# EasyEDA schematic SCH_μAtlas_2026-06-22.json

## Sheets
1 PWR_Management: TITLE: PWR Management; REV: 1.0; Date: 2026-06-20; Sheet: 1/1; Drawn By: httperry; Company: HackClub - Macondo
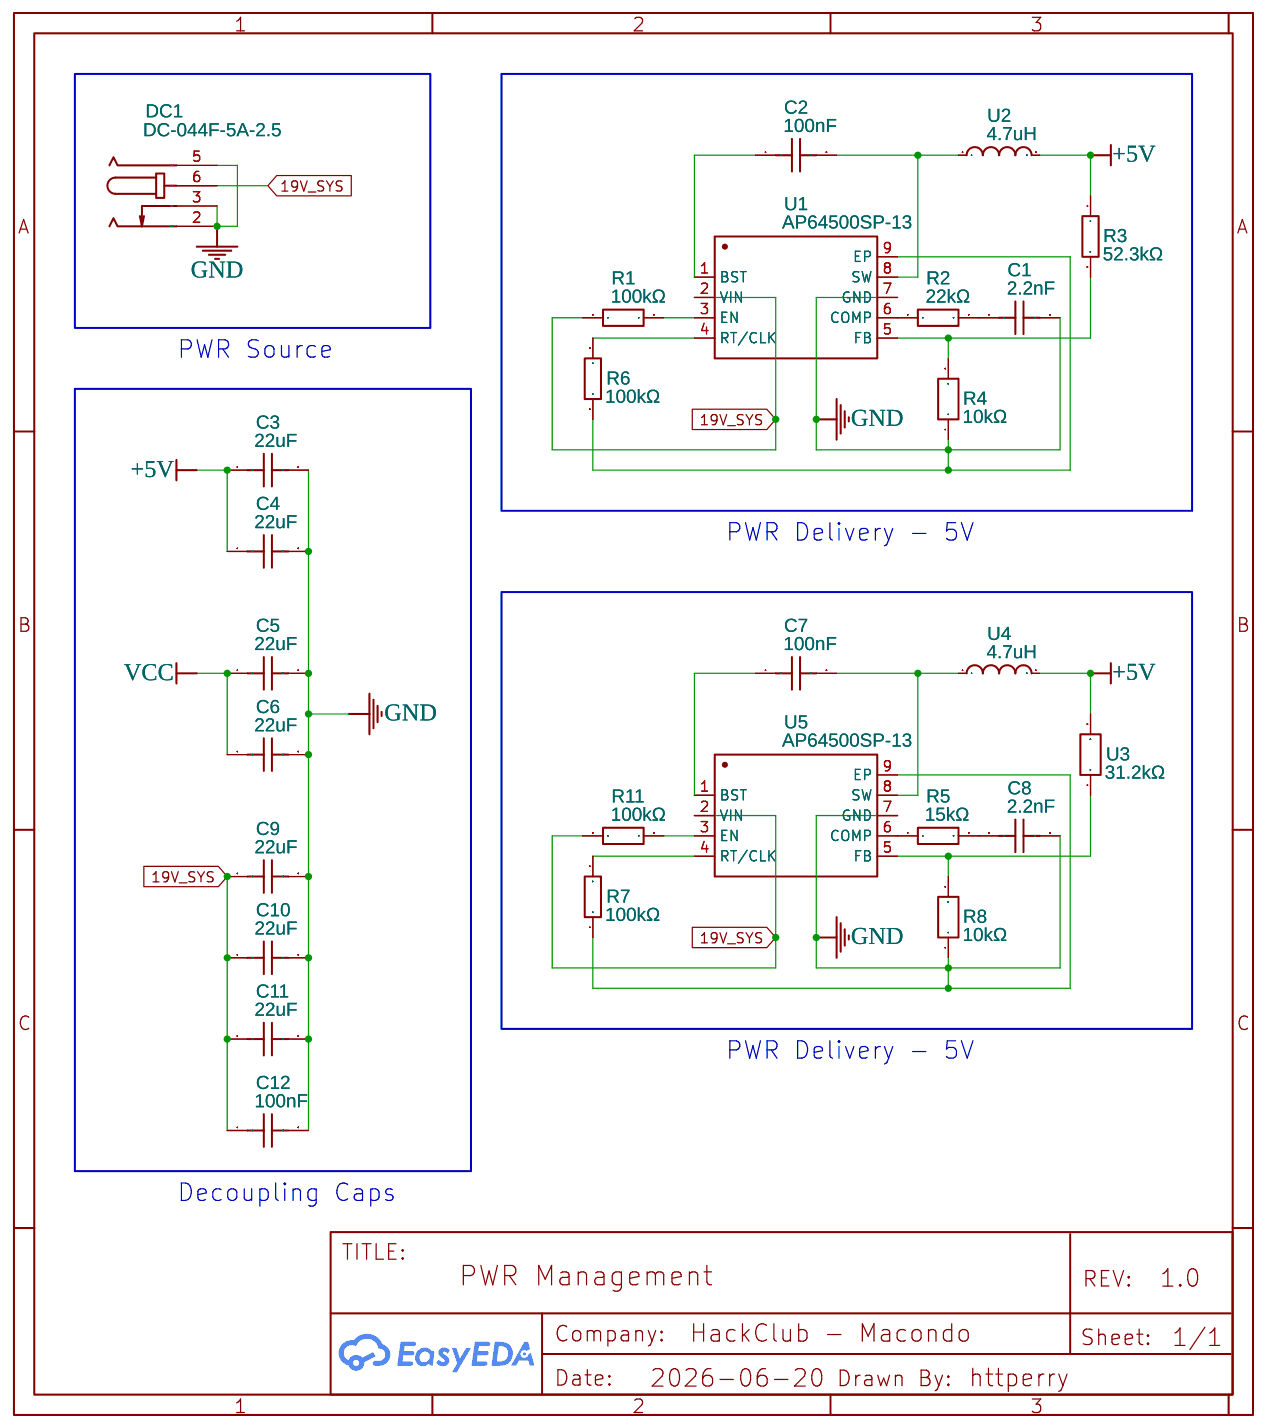
[diagram p0: PWR_Management]
2 SATA_Ports: TITLE: SATA Ports; Date: 2026-06-21
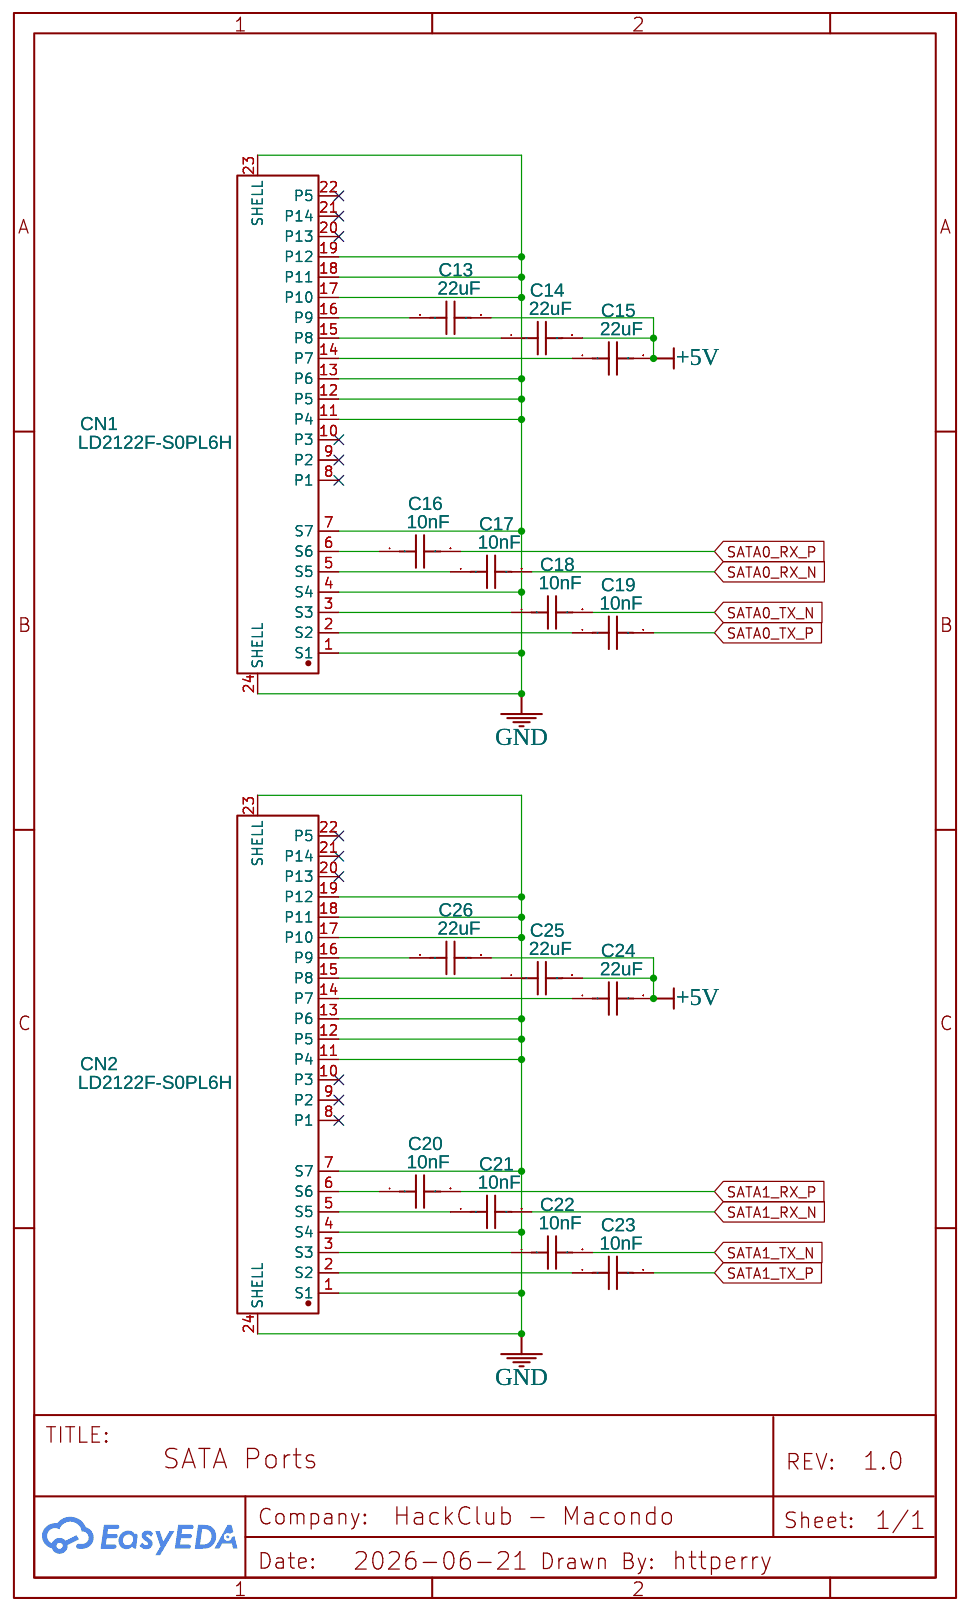
[diagram p1: SATA_Ports]
3 NVMe_(Networking)_Ports: TITLE: NVMe (Networking) Ports; Date: 2026-06-21; Company: HackClub Macondo
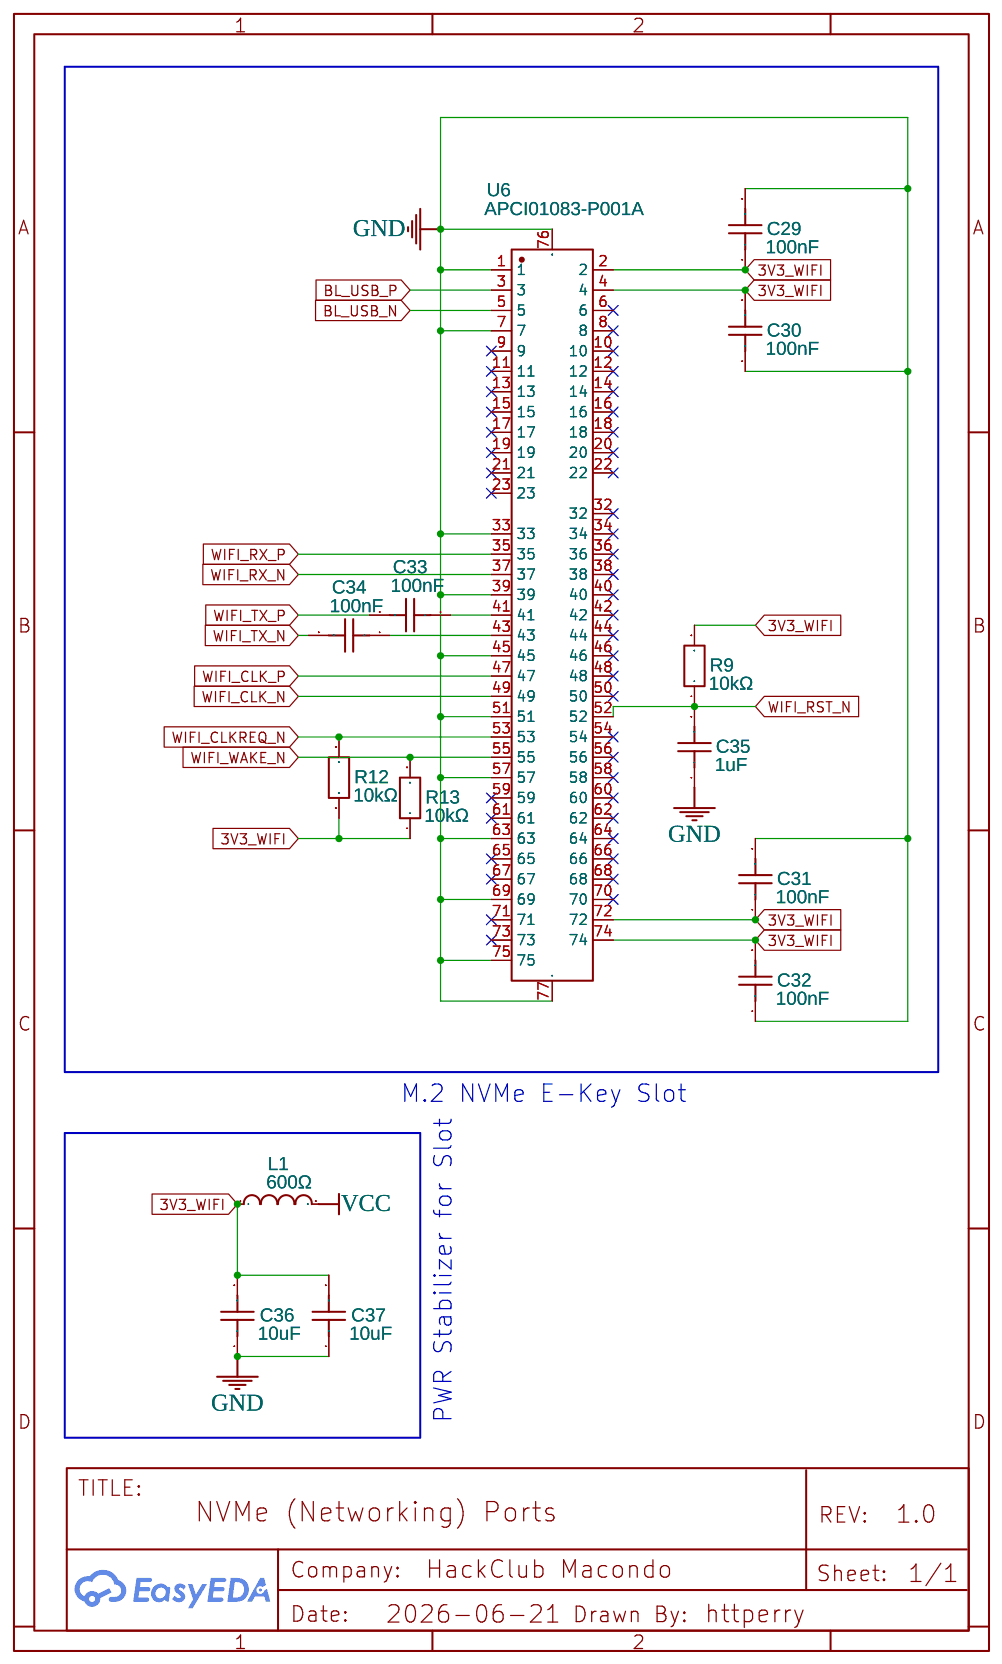
[diagram p2: NVMe_(Networking)_Ports]
4 NVMe_(Storage)_Ports: TITLE: NVMe (Storage) Ports; Date: 2026-06-22; Company: HackClub Macondo
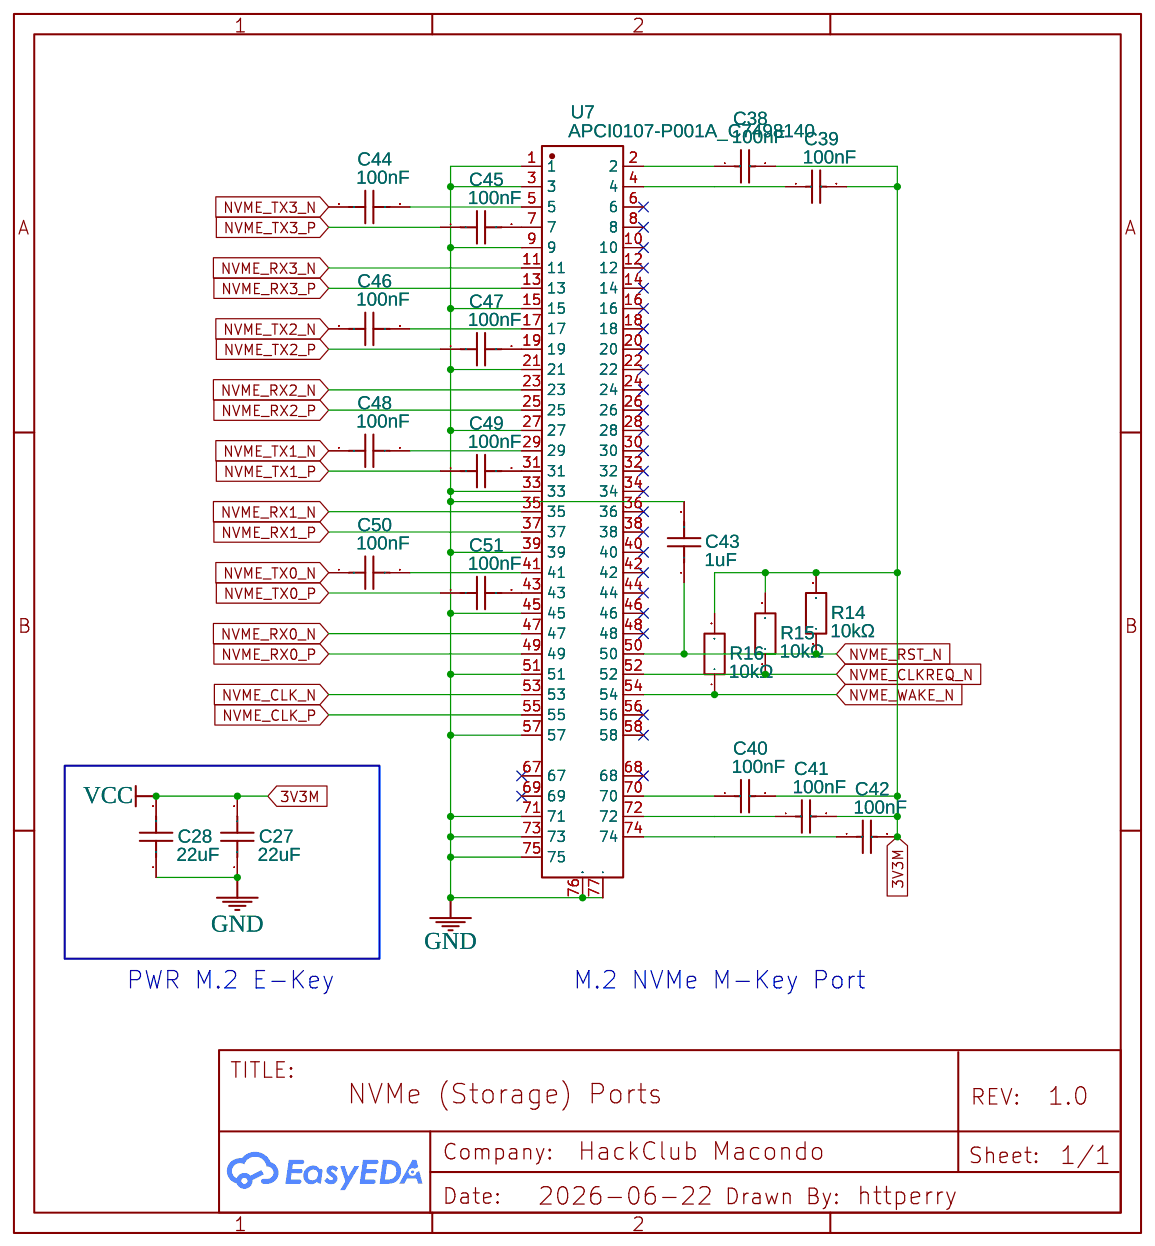
[diagram p3: NVMe_(Storage)_Ports]
5 IO_Ethernet: TITLE: IO_Ethernet; Date: 2026-06-22; Company: HackClub Macondo
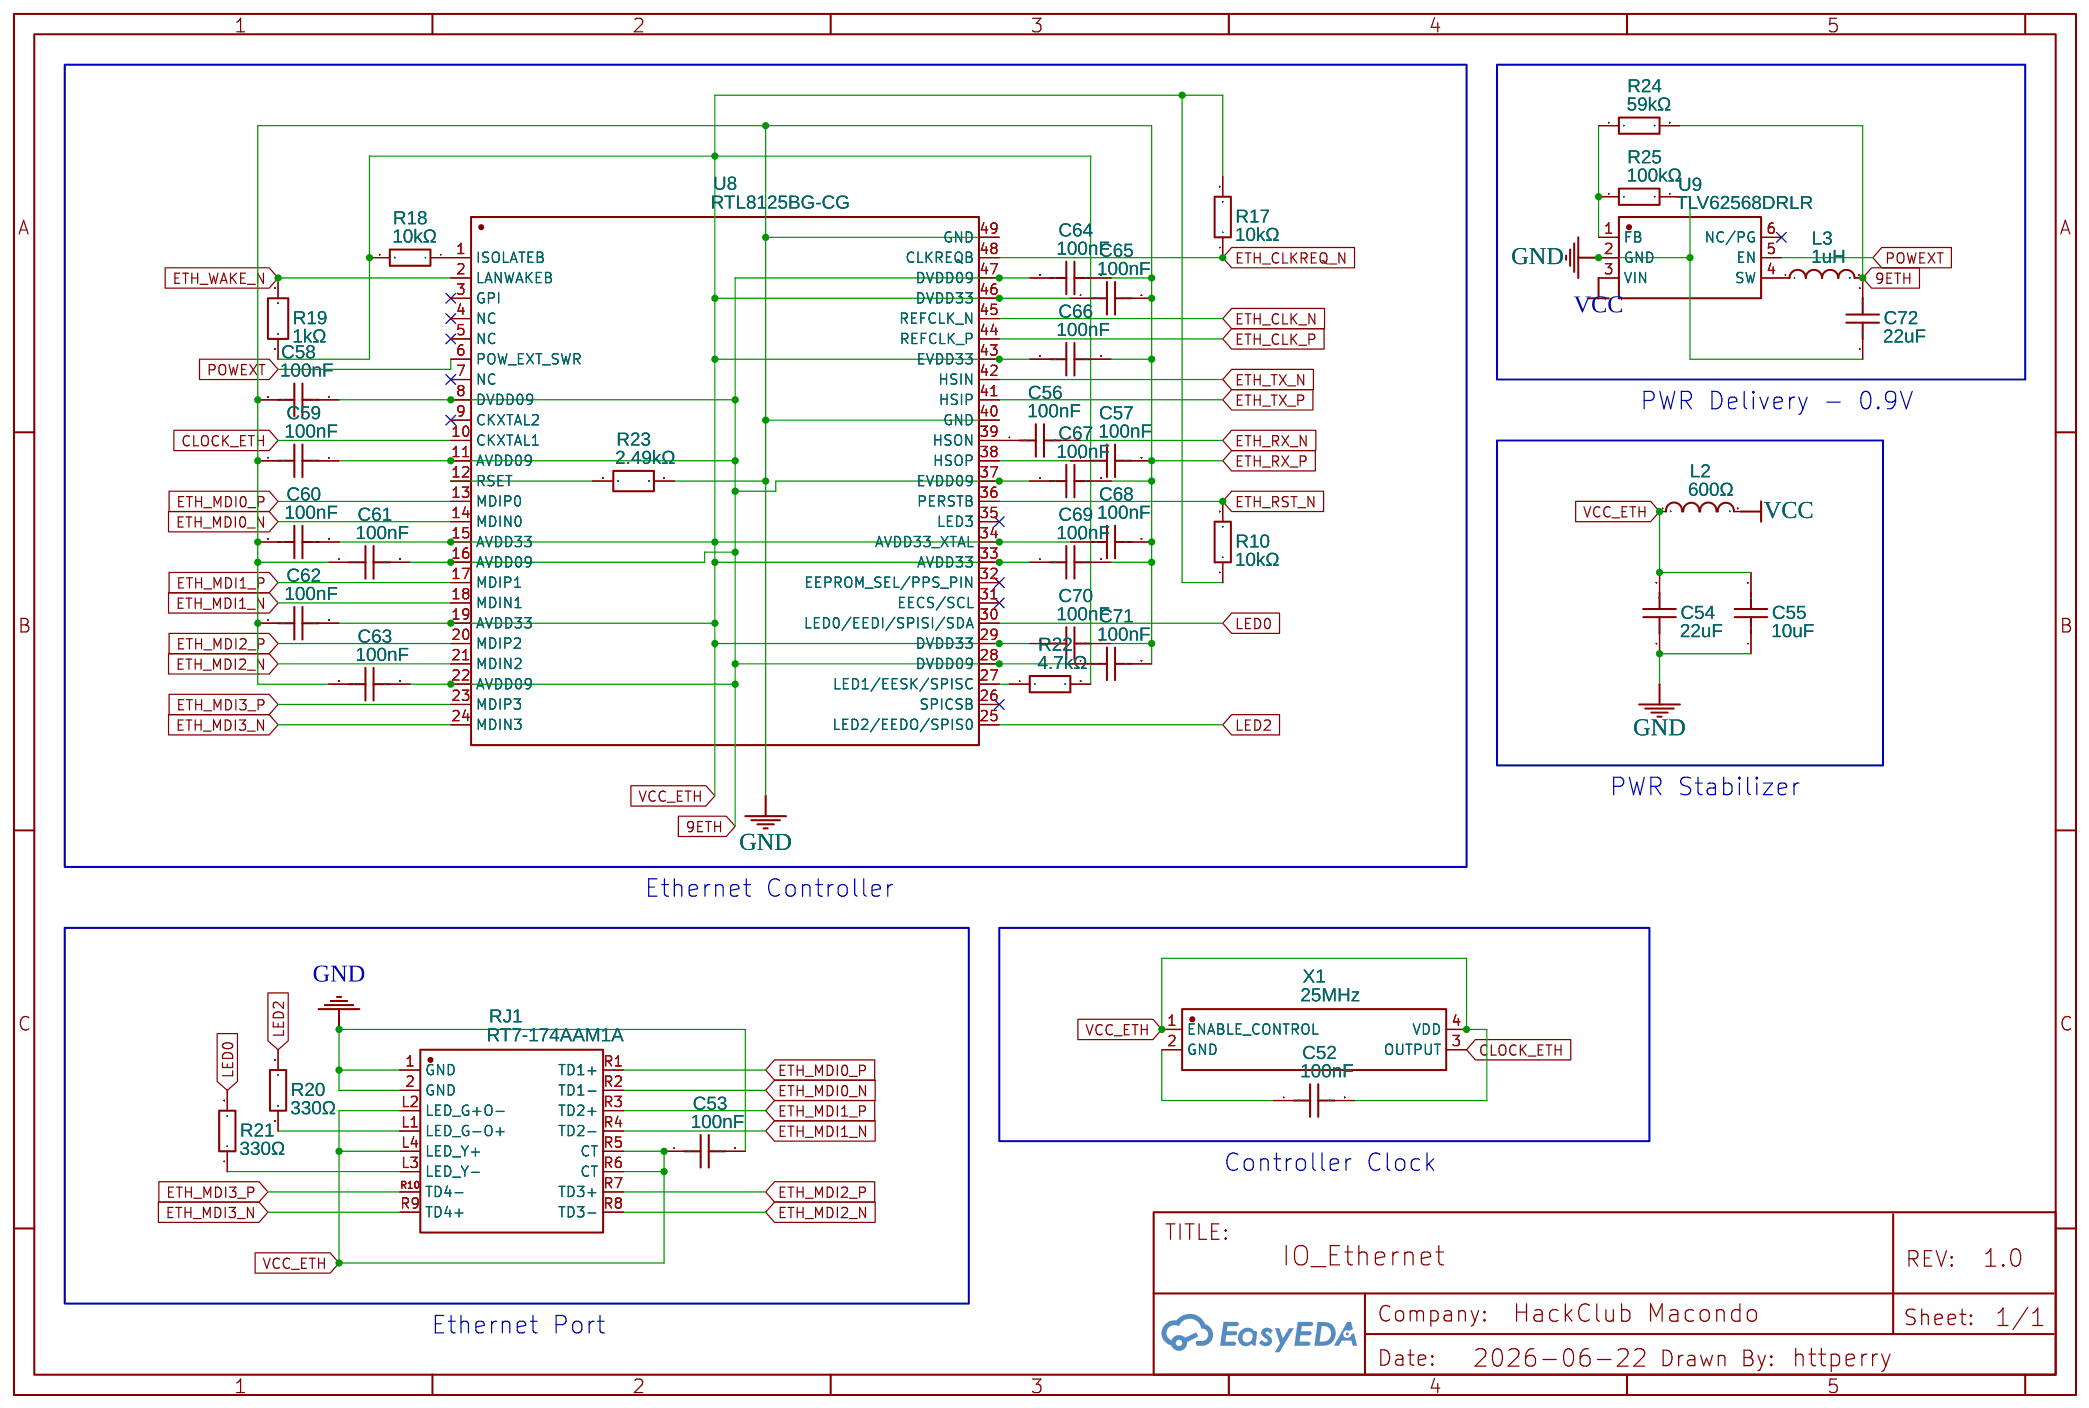
[diagram p4: IO_Ethernet]

## Parts
sheet IO_Ethernet
C52  100nF  [C0402]
C53  100nF  [C0402]
C54  22uF  [C0805]
C55  10uF  [C0805]
C56  100nF  [C0402]
C57  100nF  [C0402]
C58  100nF  [C0402]
C59  100nF  [C0402]
C60  100nF  [C0402]
C61  100nF  [C0402]
C62  100nF  [C0402]
C63  100nF  [C0402]
C64  100nF  [C0402]
C65  100nF  [C0402]
C66  100nF  [C0402]
C67  100nF  [C0402]
C68  100nF  [C0402]
C69  100nF  [C0402]
C70  100nF  [C0402]
C71  100nF  [C0402]
C72  22uF  [C0805]
L2  600Ω  [L0805]
L3  1uH  [IND-SMD_L2.0-W1.6-B]
R10  10kΩ  [R0402]
R17  10kΩ  [R0402]
R18  10kΩ  [R0402]
R19  1kΩ  [R0402]
R20  330Ω  [R0402]
R21  330Ω  [R0402]
R22  4.7kΩ  [R0402]
R23  2.49kΩ  [R0402]
R24  59kΩ  [R0603]
R25  100kΩ  [R0603]
RJ1  RT7-174AAM1A  [RJ45-TH_RT7-174AAM1A]
U8  RTL8125BG-CG  [TQFN-48_L6.0-W6.0-P0.40-BL-EP4.5]
U9  TLV62568DRLR  [SOT-563_L1.6-W1.2-P0.50-LS1.6-BL]
X1  25MHz  [OSC-SMD_4P-L3.2-W2.5-BL_SG-8018CE]
sheet NVMe_(Networking)_Ports
C29  100nF  [C0402]
C30  100nF  [C0402]
C31  100nF  [C0402]
C32  100nF  [C0402]
C33  100nF  [C0402]
C34  100nF  [C0402]
C35  1uF  [C0402]
C36  10uF  [C0805]
C37  10uF  [C0805]
L1  600Ω  [L0805]
R9  10kΩ  [R0402]
R12  10kΩ  [R0402]
R13  10kΩ  [R0402]
U6  APCI01083-P001A  [CONN-SMD_APCI01083-P001A]
sheet NVMe_(Storage)_Ports
C27  22uF  [C0805]
C28  22uF  [C0805]
C38  100nF  [C0402]
C39  100nF  [C0402]
C40  100nF  [C0402]
C41  100nF  [C0402]
C42  100nF  [C0402]
C43  1uF  [C0402]
C44  100nF  [C0402]
C45  100nF  [C0402]
C46  100nF  [C0402]
C47  100nF  [C0402]
C48  100nF  [C0402]
C49  100nF  [C0402]
C50  100nF  [C0402]
C51  100nF  [C0402]
R14  10kΩ  [R0402]
R15  10kΩ  [R0402]
R16  10kΩ  [R0402]
U7  APCI0107-P001A_C7498140  [CONN-SMD_APCI0107-P001A]
sheet PWR_Management
C1  2.2nF  [C0603]
C2  100nF  [C0603]
C3  22uF  [C0603]
C4  22uF  [C0603]
C5  22uF  [C0603]
C6  22uF  [C0603]
C7  100nF  [C0603]
C8  2.2nF  [C0603]
C9  22uF  [CAP-SMD_L6.1-W5.3-L]
C10  22uF  [CAP-SMD_L6.1-W5.3-L]
C11  22uF  [CAP-SMD_L6.1-W5.3-L]
C12  100nF  [C0603]
DC1  DC-044F-5A-2.5  [DC-IN-TH_DC-044F-5A-2.5]
R1  100kΩ  [R0603]
R2  22kΩ  [R0603]
R3  52.3kΩ  [R0603]
R4  10kΩ  [R0603]
R5  15kΩ  [R0603]
R6  100kΩ  [R0603]
R7  100kΩ  [R0603]
R8  10kΩ  [R0603]
R11  100kΩ  [R0603]
U1  AP64500SP-13  [SO-8_L4.9-W3.9-P1.27-LS6.0-BL-EP]
U2  4.7uH  [IND-SMD_L7.0-W6.6_APH0630]
U3  31.2kΩ  [R0603]
U4  4.7uH  [IND-SMD_L7.0-W6.6_APH0630]
U5  AP64500SP-13  [SO-8_L4.9-W3.9-P1.27-LS6.0-BL-EP]
sheet SATA_Ports
C13  22uF  [C0603]
C14  22uF  [C0603]
C15  22uF  [C0603]
C16  10nF  [C0402]
C17  10nF  [C0402]
C18  10nF  [C0402]
C19  10nF  [C0402]
C20  10nF  [C0402]
C21  10nF  [C0402]
C22  10nF  [C0402]
C23  10nF  [C0402]
C24  22uF  [C0603]
C25  22uF  [C0603]
C26  22uF  [C0603]
CN1  LD2122F-S0PL6H  [CONN-SMD_LD2122F-S0PL6H]
CN2  LD2122F-S0PL6H  [CONN-SMD_LD2122F-S0PL6H]

## Library data of the parts
C44-C47 C52 C53 C56-C71 = GRM155R71H104KE14J: Contributor: lcsc; Supplier: LCSC; Supplier Part: C2649519; Manufacturer: muRata(村田); JLCPCB Part Class: Extended Part
C54 C72 = GRT21BR61E226ME13L: Contributor: LCSC; Supplier: LCSC; Supplier Part: C398931; Manufacturer: muRata(村田); JLCPCB Part Class: Extended Part
C55 = TCC0805X5R106K250FT: Supplier: LCSC; Supplier Part: C5448891; Manufacturer: CCTC(三环); JLCPCB Part Class: Extended Part; Contributor: lcsc
L1 L2 = MPZ2012S601AT000: Supplier: LCSC; Manufacturer: TDK; Supplier Part: C21519; JLCPCB Part Class: Extended Part
L3 = XRIM201612S1R0MBCA: Supplier: LCSC; Supplier Part: C22471099; Manufacturer: XR(祥如); JLCPCB Part Class: Extended Part; Contributor: lcsc
R10 R17 R18 = ERA2AEB103X: Contributor: LCSC; Supplier: LCSC; Supplier Part: C191915; Manufacturer: PANASONIC(松下); JLCPCB Part Class: Extended Part
R19 = RT0402BRD071KL: Contributor: lcsc; Supplier: LCSC; Supplier Part: C852624; Manufacturer: YAGEO(国巨); JLCPCB Part Class: Extended Part
R20 R21 = RC0402JR-07330RL: Contributor: LCSC; Supplier: LCSC; Manufacturer: YAGEO(国巨); Supplier Part: C105876; JLCPCB Part Class: Extended Part
R22 = RC0402FR-074K7L: Supplier: LCSC; Manufacturer: YAGEO(国巨); Supplier Part: C105871; JLCPCB Part Class: Extended Part
R23 = FRC0402F2491TS: Supplier: LCSC; Supplier Part: C2933083; Manufacturer: FOJAN(富捷); Contributor: lcsc; JLCPCB Part Class: Extended Part
R24 = RS-03K5902FT: Contributor: LCSC; Supplier: LCSC; Supplier Part: C321955; Manufacturer: FH(风华); JLCPCB Part Class: Extended Part
R1 R6 R7 R11 R25 = RS-03K1003FT_C115320: Contributor: LCSC; Supplier: LCSC; Manufacturer: FH(风华); Manufacturer Part: RS-03K1003FT; Supplier Part: C115320; JLCPCB Part Class: Extended Part
RJ1 = RT7-174AAM1A: Contributor: LCSC; Supplier: LCSC; Supplier Part: C711505; Manufacturer: UDE(涌德电子); JLCPCB Part Class: Extended Part
U8 = RTL8125BG-CG: Contributor: lcsc; Supplier: LCSC; Supplier Part: C3013605; Manufacturer: REALTEK(瑞昱); JLCPCB Part Class: Extended Part
U9 = TLV62568DRLR: Contributor: LCSC; Supplier: LCSC; Supplier Part: C398370; Manufacturer: TI(德州仪器); JLCPCB Part Class: Extended Part
X1 = SX3M25.000B10G40TNN: Supplier: LCSC; Supplier Part: C5452698; Manufacturer: SCTF(星通时频); JLCPCB Part Class: Extended Part; Contributor: lcsc
C29-C34 = CC0402KRX5R6BB104: Contributor: LCSC; Supplier: LCSC; Supplier Part: C129131; Manufacturer: YAGEO(国巨); JLCPCB Part Class: Extended Part
C35 = TCC0402X5R105K160AT: Contributor: lcsc; Supplier: LCSC; Supplier Part: C5142580; Manufacturer: CCTC(三环); JLCPCB Part Class: Extended Part
C36 C37 = CGA0805X5R106K500MT: Supplier: LCSC; Supplier Part: C6119889; Manufacturer: HRE(芯声); JLCPCB Part Class: Extended Part; Contributor: lcsc
R9 R14-R16 = FRC0402F1002TS: Contributor: LCSC; Supplier: LCSC; Supplier Part: C2906861; Manufacturer: FOJAN(富捷); JLCPCB Part Class: Extended Part
R12 R13 = FRC0402F1002TS: Contributor: LCSC; Supplier: LCSC; Supplier Part: C2906861; Manufacturer: FOJAN(富捷); JLCPCB Part Class: Extended Part; link: https://lcsc.com/eda_search?q=C2906861&%26type=1&ref=editor
U6 = APCI01083-P001A: Supplier: LCSC; Supplier Part: C41425435; Manufacturer: LX(连欣科技); JLCPCB Part Class: Extended Part; Contributor: lcsc
C27 C28 = CL21A226MAYNNNE: Contributor: LCSC; Supplier: LCSC; Supplier Part: C602037; Manufacturer: SAMSUNG(三星); JLCPCB Part Class: Extended Part
C38-C42 = CC0402KRX5R8BB104: Supplier: LCSC; Manufacturer: YAGEO(国巨); Supplier Part: C106256; JLCPCB Part Class: Extended Part
C43 = HGC0402R5105K500NTEJ: Supplier: LCSC; Supplier Part: C7472948; Manufacturer: Chinocera(华瓷); Contributor: lcsc; JLCPCB Part Class: Extended Part
C48-C51 = GRM155R71H104KE14J: Contributor: lcsc; Supplier: LCSC; Supplier Part: C2649519; Manufacturer: muRata(村田); JLCPCB Part Class: Extended Part; link: https://lcsc.com/eda_search?q=C2649519&%26type=1&ref=editor
U7 = APCI0107-P001A_C7498140: Supplier: LCSC; Supplier Part: C7498140; Manufacturer: LX(连欣科技); Manufacturer Part: APCI0107-P001A; JLCPCB Part Class: Extended Part; Contributor: lcsc
C1 C8 = FCC0603B222K500CT: Supplier: LCSC; Supplier Part: C5137562; Manufacturer: FOJAN(富捷); Contributor: lcsc; JLCPCB Part Class: Extended Part
C2 C7 C12 = GRM188R71H104KA93D: Supplier: LCSC; Manufacturer: muRata(村田); Supplier Part: C77055; JLCPCB Part Class: Extended Part
C3-C6 C13-C15 C24-C26 = HGC0603R5226M160NTHJ: Supplier: LCSC; Supplier Part: C22367828; Manufacturer: Chinocera(华瓷); JLCPCB Part Class: Extended Part; Contributor: lcsc
C9-C11 = KCM55QR71H226KH13K: Supplier: LCSC; Supplier Part: C6579204; Manufacturer: muRata(村田); JLCPCB Part Class: Extended Part; Contributor: lcsc
DC1 = DC-044F-5A-2.5: Supplier: LCSC; Supplier Part: C779941; Manufacturer: XKB Connection(中国星坤); JLCPCB Part Class: Extended Part; Contributor: lcsc
R2 = RS-03K2202FT: Contributor: LCSC; Supplier: LCSC; Supplier Part: C286577; Manufacturer: FH(风华); JLCPCB Part Class: Extended Part
R3 = RS-03K5232FT: Contributor: LCSC; Supplier: LCSC; Supplier Part: C304764; Manufacturer: FH(风华); JLCPCB Part Class: Extended Part
R4 R8 = AR03BTS1002: Supplier: LCSC; Supplier Part: C20607729; Manufacturer: Viking(光颉); JLCPCB Part Class: Extended Part; Contributor: lcsc
R5 = CR0603FA1502G: Supplier: LCSC; Manufacturer: LIZ(丽智电子); Supplier Part: C100780; JLCPCB Part Class: Extended Part
U1 U5 = AP64500SP-13: Contributor: LCSC; Supplier: LCSC; Supplier Part: C2070920; Manufacturer: DIODES(美台); JLCPCB Part Class: Extended Part
U2 U4 = APH0630T4R7M: Supplier: LCSC; Supplier Part: C5349705; Manufacturer: APV(爱普微); JLCPCB Part Class: Extended Part; Contributor: lcsc
U3 = RT0603DRE0731K2L: Supplier: LCSC; Supplier Part: C863036; Manufacturer: YAGEO(国巨); JLCPCB Part Class: Extended Part; Contributor: lcsc
C16-C23 = FCC0402B103K500AT: Supplier: LCSC; Supplier Part: C5137480; Manufacturer: FOJAN(富捷); JLCPCB Part Class: Extended Part; Contributor: lcsc; link: https://lcsc.com/eda_search?q=C5137480&%26type=1&ref=editor
CN1 CN2 = LD2122F-S0PL6H: Contributor: LCSC; Supplier: LCSC; Supplier Part: C2761452; Manufacturer: FOXCONN(富士康); JLCPCB Part Class: Extended Part

## Nets
3V3_WIFI: C29.1 C30.2 C31.1 C32.2 C36.2 C37.2 L1.1 R9.2 R12.1 R13.1 U6.2 U6.4 U6.72 U6.74
3V3M: C5.1 C6.1 C27.2 C28.2 C38.2 C39.2 C40.2 C41.2 C42.2 L1.2 L2.2 R14.2 R15.2 R16.2 U9.3(VIN)
19V_SYS: C9.1 C10.1 C11.1 C12.1 DC1.6 R1.1 R11.1 U1.2(VIN) U5.2(VIN)
+5V: C3.1 C4.1 C13.2 C14.2 C15.2 C24.2 C25.2 C26.2 R3.1 U2.2 U3.2 U4.2
VCC_ETH: C52.2 C53.1 C54.2 C55.2 C60.2 C62.2 C65.1 C66.1 C68.1 C69.1 C70.1 L2.1 R10.1 R17.2 R18.2 R19.1 R22.2 RJ1.L2(LED_G+O-) RJ1.L4(LED_Y+) RJ1.R5(CT) RJ1.R6(CT) U8.15(AVDD33) U8.19(AVDD33) U8.29(DVDD33) U8.33(AVDD33) U8.34(AVDD33_XTAL) U8.43(EVDD33) U8.46(DVDD33) X1.1(ENABLE CONTROL) X1.4(VDD)
9ETH: C58.1 C59.2 C61.2 C63.2 C64.1 C67.1 C71.1 C72.2 L3.2 R24.2 U8.8(DVDD09) U8.11(AVDD09) U8.16(AVDD09) U8.22(AVDD09) U8.28(DVDD09) U8.37(EVDD09) U8.47(DVDD09)
BL_USB_N: U6.5
BL_USB_P: U6.3
CLOCK_ETH: U8.10(CKXTAL1) X1.3(OUTPUT)
ETH_CLK_N: U8.45(REFCLK_N)
ETH_CLK_P: U8.44(REFCLK_P)
ETH_CLKREQ_N: R17.1 U8.48(CLKREQB)
ETH_MDI0_N: RJ1.R2(TD1-) U8.14(MDIN0)
ETH_MDI0_P: RJ1.R1(TD1+) U8.13(MDIP0)
ETH_MDI1_N: RJ1.R4(TD2-) U8.18(MDIN1)
ETH_MDI1_P: RJ1.R3(TD2+) U8.17(MDIP1)
ETH_MDI2_N: RJ1.R8(TD3-) U8.21(MDIN2)
ETH_MDI2_P: RJ1.R7(TD3+) U8.20(MDIP2)
ETH_MDI3_N: RJ1.R9(TD4+) U8.24(MDIN3)
ETH_MDI3_P: RJ1.R10(TD4-) U8.23(MDIP3)
ETH_RST_N: R10.2 U8.36(PERSTB)
ETH_RX_N: C56.2
ETH_RX_P: C1.2 C3.2 C4.2 C5.2 C6.2 C8.2 C9.2 C10.2 C11.2 C12.2 C27.1 C28.1 C29.2 C30.1 C31.2 C32.1 C35.1 C36.1 C37.1 C43.2 C53.2 C54.1 C55.1 C57.2 C58.2 C59.1 C60.1 C61.1 C62.1 C63.1 C64.2 C65.2 C66.2 C67.2 C68.2 C69.2 C70.2 C71.2 C72.1 CN1.1(S1) CN1.4(S4) CN1.7(S7) CN1.11(P4) CN1.12(P5) CN1.13(P6) CN1.17(P10) CN1.18(P11) CN1.19(P12) CN1.23(SHELL) CN1.24(SHELL) CN2.1(S1) CN2.4(S4) CN2.7(S7) CN2.11(P4) CN2.12(P5) CN2.13(P6) CN2.17(P10) CN2.18(P11) CN2.19(P12) CN2.23(SHELL) CN2.24(SHELL) DC1.2 DC1.3 DC1.5 R4.1 R6.1 R7.1 R8.1 R23.1 R25.2 RJ1.1(GND) RJ1.2(GND) U1.7(GND) U1.9(EP) U5.7(GND) U5.9(EP) U6.1 U6.7 U6.33 U6.39 U6.45 U6.51 U6.57 U6.63 U6.69 U6.75 U6.76 U6.77 U7.1 U7.3 U7.9 U7.15 U7.21 U7.27 U7.33 U7.39 U7.45 U7.51 U7.57 U7.71 U7.73 U7.75 U7.76 U7.77 U8.40(GND) U8.49(GND) U9.2(GND)
ETH_TX_N: U8.42(HSIN)
ETH_TX_P: U8.41(HSIP)
ETH_WAKE_N: R19.2 U8.2(LANWAKEB)
LED0: R21.2 U8.30(LED0/EEDI/SPISI/SDA)
LED2: R20.1 U8.25(LED2/EEDO/SPIS0)
NVME_CLK_N: U7.53
NVME_CLK_P: U7.55
NVME_CLKREQ_N: R15.1 U7.52
NVME_RST_N: C43.1 R14.1 U7.50
NVME_RX0_N: U7.47
NVME_RX0_P: U7.49
NVME_RX1_N: U7.35
NVME_RX1_P: U7.37
NVME_RX2_N: U7.23
NVME_RX2_P: U7.25
NVME_RX3_N: U7.11
NVME_RX3_P: U7.13
NVME_TX0_N: C50.1
NVME_TX0_P: C51.1
NVME_TX1_N: C48.1
NVME_TX1_P: C49.1
NVME_TX2_N: C46.1
NVME_TX2_P: C47.1
NVME_TX3_N: C44.1
NVME_TX3_P: C45.1
NVME_WAKE_N: R16.1 U7.54
POWEXT: U8.6(POW_EXT_SWR) U9.5(EN)
SATA0_RX_N: C17.2
SATA0_RX_P: C16.2
SATA0_TX_N: C18.2
SATA0_TX_P: C19.2
SATA1_RX_N: C21.2
SATA1_RX_P: C20.2
SATA1_TX_N: C22.2
SATA1_TX_P: C23.2
WIFI_CLK_N: U6.49
WIFI_CLK_P: U6.47
WIFI_CLKREQ_N: R12.2 U6.53
WIFI_RST_N: C35.2 R9.1 U6.52
WIFI_RX_N: U6.37
WIFI_RX_P: U6.35
WIFI_TX_N: C34.2
WIFI_TX_P: C33.2
WIFI_WAKE_N: R13.2 U6.55
Net-(C1-1): C1.1 R2.2
Net-(C2-1): C2.1 U1.1(BST)
Net-(C2-2): C2.2 U1.8(SW) U2.1
Net-(C7-1): C7.1 U5.1(BST)
Net-(C7-2): C7.2 U4.1 U5.8(SW)
Net-(C8-1): C8.1 R5.2
Net-(C13-1): C13.1 CN1.16(P9)
Net-(C14-1): C14.1 CN1.15(P8)
Net-(C15-1): C15.1 CN1.14(P7)
Net-(C16-1): C16.1 CN1.6(S6)
Net-(C17-1): C17.1 CN1.5(S5)
Net-(C18-1): C18.1 CN1.3(S3)
Net-(C19-1): C19.1 CN1.2(S2)
Net-(C20-1): C20.1 CN2.6(S6)
Net-(C21-1): C21.1 CN2.5(S5)
Net-(C22-1): C22.1 CN2.3(S3)
Net-(C23-1): C23.1 CN2.2(S2)
Net-(C24-1): C24.1 CN2.14(P7)
Net-(C25-1): C25.1 CN2.15(P8)
Net-(C26-1): C26.1 CN2.16(P9)
Net-(C33-1): C33.1 U6.41
Net-(C34-1): C34.1 U6.43
Net-(C38-1): C38.1 U7.2
Net-(C39-1): C39.1 U7.4
Net-(C40-1): C40.1 U7.70
Net-(C41-1): C41.1 U7.72
Net-(C42-1): C42.1 U7.74
Net-(C44-2): C44.2 U7.5
Net-(C45-2): C45.2 U7.7
Net-(C46-2): C46.2 U7.17
Net-(C47-2): C47.2 U7.19
Net-(C48-2): C48.2 U7.29
Net-(C49-2): C49.2 U7.31
Net-(C50-2): C50.2 U7.41
Net-(C51-2): C51.2 U7.43
Net-(C52-1): C52.1 X1.2(GND)
Net-(C56-1): C56.1 U8.39(HSON)
Net-(C57-1): C57.1 U8.38(HSOP)
Net-(L3-1): L3.1 U9.4(SW)
Net-(R1-2): R1.2 U1.3(EN)
Net-(R2-1): R2.1 U1.6(COMP)
Net-(R3-2): R3.2 R4.2 U1.5(FB)
Net-(R5-1): R5.1 U5.6(COMP)
Net-(R6-2): R6.2 U1.4(RT/CLK)
Net-(R7-2): R7.2 U5.4(RT/CLK)
Net-(R8-2): R8.2 U3.1 U5.5(FB)
Net-(R11-2): R11.2 U5.3(EN)
Net-(R18-1): R18.1 U8.1(ISOLATEB)
Net-(R20-2): R20.2 RJ1.L1(LED_G-O+)
Net-(R21-1): R21.1 RJ1.L3(LED_Y-)
Net-(R22-1): R22.1 U8.27(LED1/EESK/SPISC)
Net-(R23-2): R23.2 U8.12(RSET)
Net-(R24-1): R24.1 R25.1 U9.1(FB)

Not connected (* = marked no-connect by the designer): CN1 8(P1)* 9(P2)* 10(P3)* 20(P13)* 21(P14)* 22(P5)*; CN2 8(P1)* 9(P2)* 10(P3)* 20(P13)* 21(P14)* 22(P5)*; U6 6* 8* 9* 10* 11* 12* 13* 14* 15* 16* 17* 18* 19* 20* 21* 22* 23* 32* 34* 36* 38* 40* 42* 44* 46* 48* 50* 54* 56* 58* 59* 60* 61* 62* 64* 65* 66* 67* 68* 70* 71* 73*; U7 6* 8* 10* 12* 14* 16* 18* 20* 22* 24* 26* 28* 30* 32* 34* 36* 38* 40* 42* 44* 46* 48* 56* 58* 67* 68* 69*; U8 3(GPI)* 4(NC)* 5(NC)* 7(NC)* 9(CKXTAL2)* 26(SPICSB)* 31(EECS/SCL)* 32(EEPROM_SEL/PPS_PIN)* 35(LED3)*; U9 6(NC/PG)*

## Notes on the sheets
sheet 1
- PWR Source
- PWR Delivery - 5V
- PWR Delivery - 5V
- Decoupling Caps
sheet 3
- M.2 NVMe E-Key Slot
- PWR Stabilizer for Slot
sheet 4
- PWR M.2 E-Key
- M.2 NVMe M-Key Port
sheet 5
- PWR Delivery - 0.9V
- PWR Stabilizer
- Ethernet Controller
- Controller Clock
- Ethernet Port
